# EAGLE design 24v_reg_motor (EAGLE 6.3)
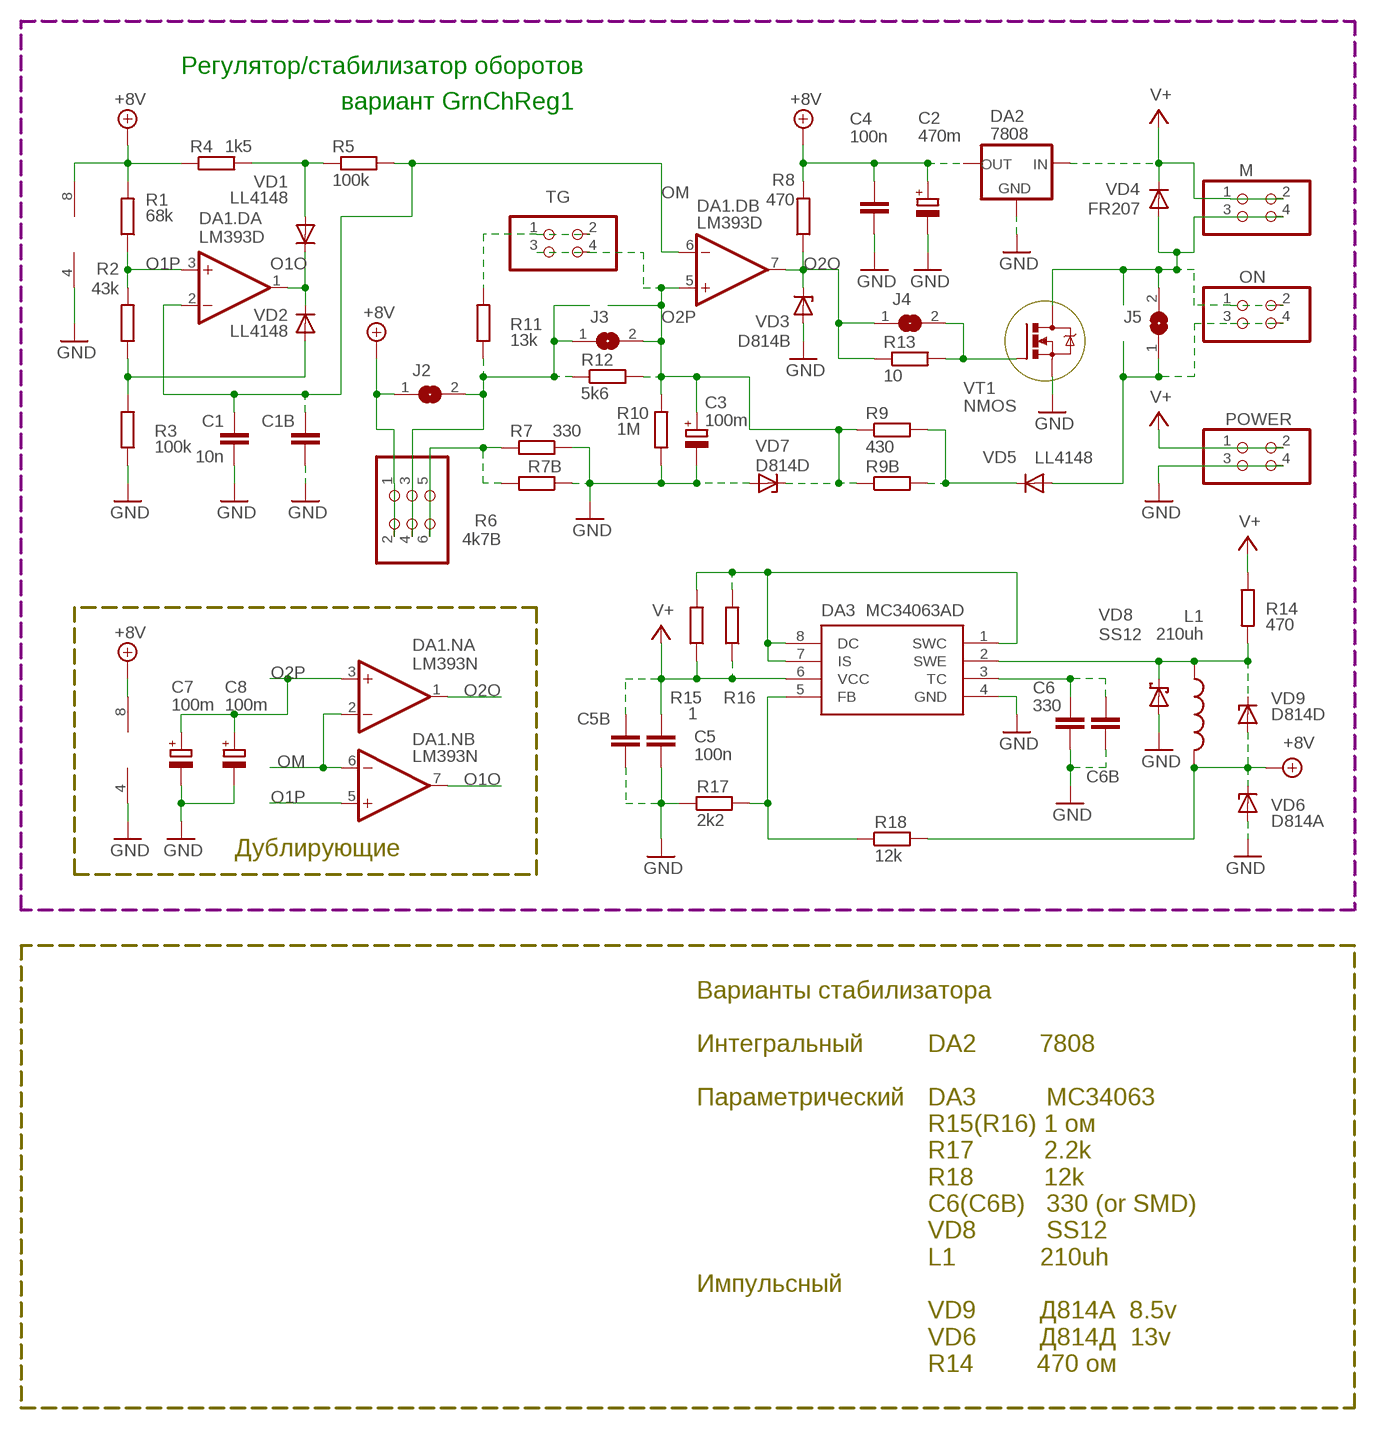
[diagram p0: schematic, sheet 1]

## Parts
C1  10n  C-EU025-025X050  [C025-025X050]
C1B  C-EUC0805  [C0805]
C2  470m  CPOL-EUE5-8.5  [E5-8,5]
C3  100m  CPOL-EUE2.5-7  [E2,5-7]
C4  100n  C-EUC1206K  [C1206K]
C5  100n  C-EU025-024X044  [C025-024X044]
C5B  C-EUC1206  [C1206]
C6  330  C-EU025-025X050  [C025-025X050]
C6B  C-EUC0805  [C0805]
C7  100m  CPOL-EUE22-6AXIAL  [E22-6]
C8  100m  CPOL-EUE22-6AXIAL  [E22-6]
DA1.D  LM393D  [SO08]
DA1.N  LM393N  [DIL08]
DA2  7808  79XXL  [79XXL]
DA3  MC34063AD  [SOIC8]
J2  SJ  [SJ]
J3  SJ  [SJ]
J4  SJ  [SJ]
J5  SJ  [SJ]
L1  210uh  L-US0207/10  [0207/10]
M  PINHD-2X2  [2X02]
ON  PINHD-2X2  [2X02]
POWER  PINHD-2X2  [2X02]
R1  68k  R-EU_0207/10  [0207/10]
R2  43k  R-EU_M0805  [M0805]
R3  100k  R-EU_M0805  [M0805]
R4  1k5  R-EU_M0805  [M0805]
R5  100k  R-EU_M0805  [M0805]
R6  4k7B  PINHD-2X3  [2X03]
R7  330  R-EU_0309/10  [0309/10]
R7B  R-EU_M0805  [M0805]
R8  470  R-EU_M0805  [M0805]
R9  430  R-EU_0207/10  [0207/10]
R9B  R-EU_R0805  [R0805]
R10  1M  R-EU_M0805  [M0805]
R11  13k  R-EU_0207/10  [0207/10]
R12  5k6  R-EU_M0805  [M0805]
R13  10  R-EU_R0805  [R0805]
R14  470  R-EU_0207/10  [0207/10]
R15  1  R-EU_M0805  [M0805]
R16  R-EU_M0805  [M0805]
R17  2k2  R-EU_M0805  [M0805]
R18  12k  R-EU_0207/10  [0207/10]
TG  PINHD-2X2  [2X02]
VD1  LL4148  DIODE-SOD80C  [SOD80C]
VD2  LL4148  DIODE-SOD80C  [SOD80C]
VD3  D814B  ZDD814  [ZDMETAL]
VD4  FR207  1N4148DO35-10  [DO35-10]
VD5  LL4148  DIODE-SOD80C  [SOD80C]
VD6  D814A  ZDD814  [ZDMETAL]
VD7  D814D  ZDD814  [ZDMETAL]
VD8  SS12  SCHOTTKY-DIODESMD  [SMB]
VD9  D814D  ZDD814  [ZDMETAL]
VT1  NMOS  NMOSD  [DPACK_1]

## Nets
34P2: DA3.2(SWE) L1.1 R14.2 VD8.C VD9.C
+8V: C2.+ C4.1 DA1.D.8(P:V+) DA1.N.8(P:V+) DA2.OUT J2.1 L1.2 R1.2 R4.1 R6.1 R6.2 R8.2 R18.2 VD6.C VD9.A
GND: C1.2 C1B.2 C2.- C3.- C4.2 C5.2 C5B.2 C6.2 C6B.2 C7.- C8.- DA1.D.4(P:V-) DA1.N.4(P:V-) DA2.GND DA3.4(GND) POWER.3 POWER.4 R3.1 R7.1 R7B.1 R10.1 R17.1 VD3.A VD6.A VD7.A VD8.A VT1.S
N$3: R2.1 R3.2 VD2.A
N$5: R4.2 R5.1 VD1.A
N$7: R6.5 R6.6 R7.2 R7B.2
N$9: DA3.1(SWC) DA3.7(IS) DA3.8(DC) R15.2 R16.2
N$11: J5.2 M.3 M.4 ON.1 ON.2 VD4.A VT1.D
N$12: J4.2 R13.2 VT1.G
N$13: R11.2 TG.1 TG.2
N$14: J5.1 ON.3 ON.4 VD5.A
N$15: R9.2 R9B.2 VD5.C
N$17: J2.2 J3.1 R6.3 R6.4 R11.1 R12.1
N$18: DA3.5(FB) R17.2 R18.1
N$20: C6.1 C6B.1 DA3.3(TC)
O1O: DA1.D.1(A:OUT) DA1.N.7(B:OUT) VD1.C VD2.C
O1P: DA1.D.3(A:+IN) DA1.N.5(B:+IN) R1.1 R2.2
O2O: DA1.D.7(B:OUT) DA1.N.1(A:OUT) J4.1 R8.1 R13.1 VD3.C
O2P: C3.+ C7.+ C8.+ DA1.D.5(B:+IN) DA1.N.3(A:+IN) J3.2 R9.1 R9B.1 R10.2 R12.2 TG.3 TG.4 VD7.C
OM: C1.1 C1B.1 DA1.D.2(A:-IN) DA1.D.6(B:-IN) DA1.N.2(A:-IN) DA1.N.6(B:-IN) R5.2
V+: C5.1 C5B.1 DA2.IN DA3.6(VCC) M.1 M.2 POWER.1 POWER.2 R14.1 R15.1 R16.1 VD4.C

## Notes on the sheet
- Регулятор/стабилизатор оборотов
- вариант GrnChReg1
- Дублирующие
- Варианты стабилизатора
- Интегральный
  
  Параметрический
  
  
  
  
  
  
  Импульсный
- DA2         7808
  
  DA3          MC34063
  R15(R16) 1 ом
  R17          2.2k
  R18          12k
  C6(C6B)   330 (or SMD)
  VD8          SS12
  L1            210uh
  
  VD9         Д814А  8.5v
  VD6         Д814Д  13v
  R14         470 ом

## Library data of the parts
C1 C1B C4 C6 C6B = rcl:C-EU: CAPACITOR, European symbol
C2 C3 C7 C8 = rcl:CPOL-EU: POLARIZED CAPACITOR, European symbol
C5 C5B = rc-elektronik:C-EU: CAPACITOR, European symbol
DA1.D DA1.N = linear:LM393: COMPARATOR
DA2 = v-reg:79XXL: VOLTAGE REGULATOR
DA3 = mc34063:MC34063
J2-J5 = jumper:SJ: SMD solder JUMPER
L1 = rcl:L-US: INDUCTOR, American symbol
M ON POWER TG = pinhead:PINHD-2X2: PIN HEADER
R1-R5 R7 R7B R8 R9 R9B R10-R18 = rcl:R-EU_: RESISTOR, European symbol
R6 = pinhead:PINHD-2X3: PIN HEADER
VD1 VD2 VD5 = diode:DIODE-: DIODE
VD3 VD6 VD7 VD9 = DSS0:ZD
VD4 = SpeccyPower5v:1N4148: DIODE high speed (Philips)
VD8 = diode:SCHOTTKY-DIODE: Schottky Diode
VT1 = DSS0:NMOS

## Board
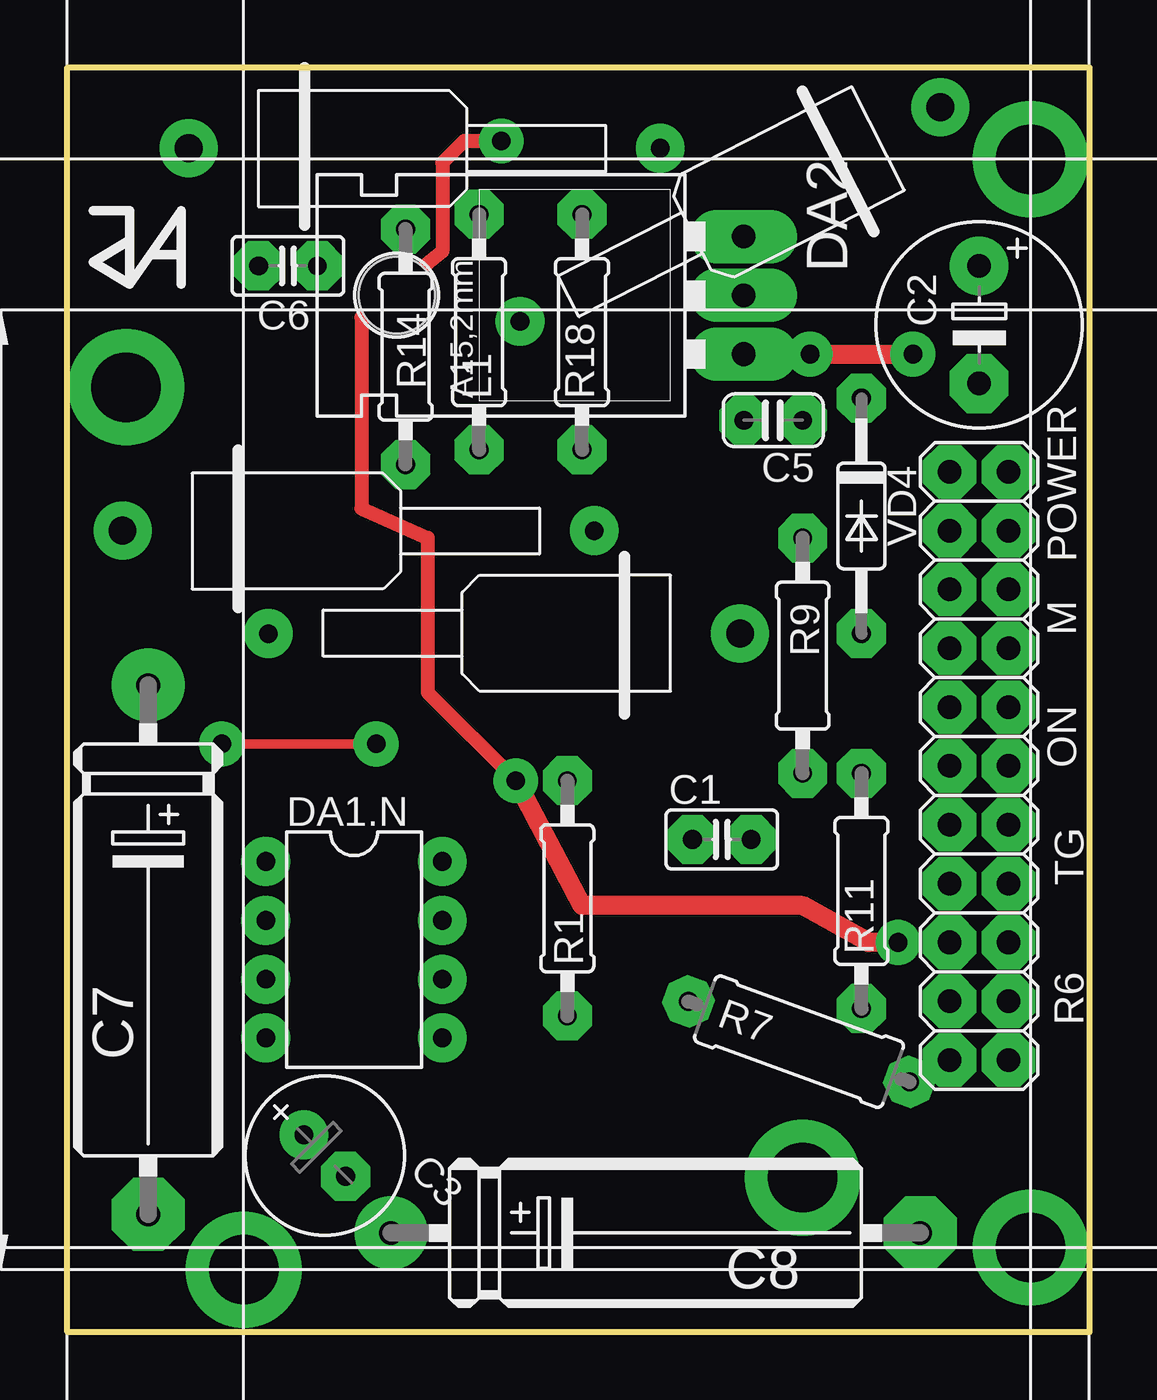
[diagram p1: board, top side]
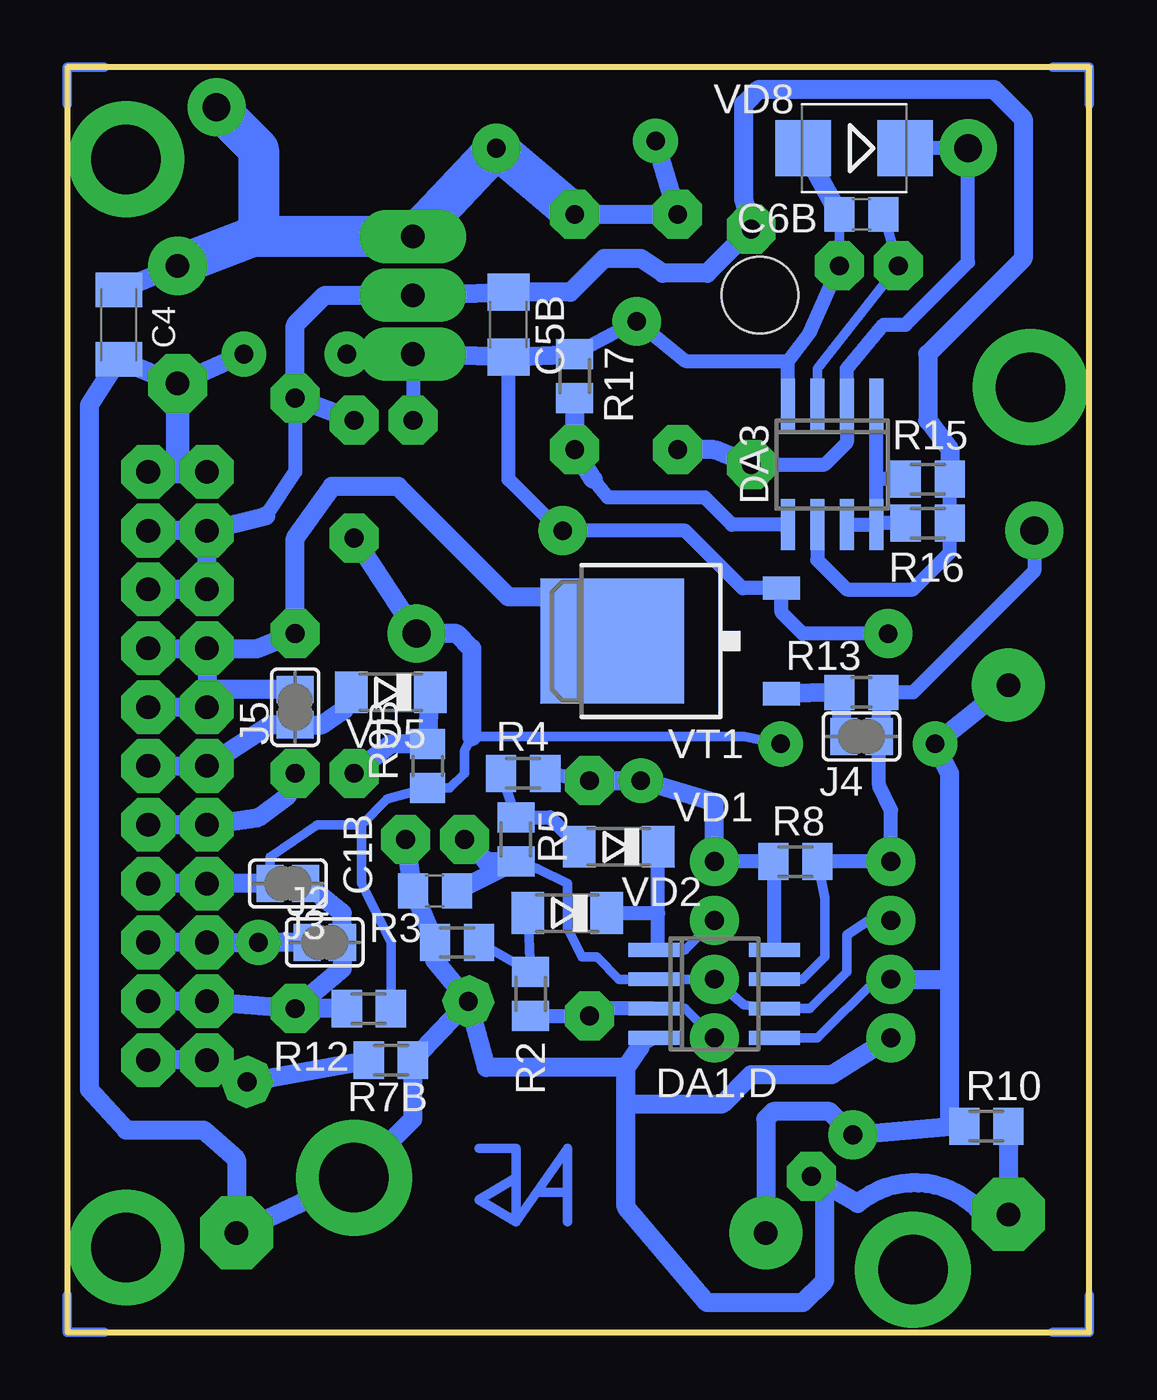
[diagram p2: board, bottom side, seen from below]

Size 44.13 x 54.61 mm. Coordinates in mm from the lower left corner, seen from the top.
Outline: 0,54.61 44.13,54.61 44.13,0 0,0 0,54.61
Copper layers (1*16): Top 0.035mm / dielectric 1.5mm / Bottom 0.035mm
Design rules "DesignRules": minimum track width 8mil, minimum drill 24mil, track to track 0.2mm, track to pad 0.2mm, pad to pad 8mil, via to via 8mil, smd to smd 8mil, copper to edge 10mil, drill to drill 8mil, minimum pad ring 0.65mm, minimum via ring 8mil, stop-mask expansion 4mil, vias tented up to drill 0mil, thermal gap 10mil

### Footprints (pad centres in the part's own frame; a part is rotated, then mirrored left to right if it is on the bottom)
C025-025X050 = drill 0.813 octagon: 1 -1.27,0; 2 1.27,0
C0805 = smd 1.3 x 1.5: 1 -0.95,0; 2 0.95,0
E5-8,5 = drill 1.016 pad 2.54: + -2.54,0 | drill 1.016 pad 2.54 octagon: - 2.54,0
E2,5-7 = drill 0.813 pad 1.6: + -1.27,0 | drill 0.813 pad 1.6 octagon: - 1.27,0
C1206K = smd 1.5 x 2: 1 -1.5,0; 2 1.5,0
C025-024X044 = drill 0.813 octagon: 1 -1.27,0; 2 1.27,0
C1206 = smd 1.6 x 1.8: 1 -1.4,0; 2 1.4,0
E22-6 = drill 1.016 pad 3.15: + -11.43,0 | drill 1.016 pad 3.15 octagon: - 11.43,0
SO08 = smd 0.6 x 2.2: 1 -1.905,-2.6; 2 -0.635,-2.6; 3 0.635,-2.6; 4 1.905,-2.6; 5 1.905,2.6; 6 0.635,2.6; 7 -0.635,2.6; 8 -1.905,2.6
DIL08 = drill 0.813 pad 1.27: 1 -3.81,-3.81; 2 -1.27,-3.81; 3 1.27,-3.81; 4 3.81,-3.81; 5 3.81,3.81; 6 1.27,3.81; 7 -1.27,3.81; 8 -3.81,3.81
79XXL = drill 1.016 long: GND -2.54,-3.81; IN 0,-3.81; OUT 2.54,-3.81 | hole 3.302: 0,11.176
SOIC8 = smd 0.6 x 2.2: 1 -1.905,-2.6; 2 -0.635,-2.6; 3 0.635,-2.6; 4 1.905,-2.6; 5 1.905,2.6; 6 0.635,2.6; 7 -0.635,2.6; 8 -1.905,2.6
SJ = smd 1.168 x 1.6: 1 -0.762,0; 2 0.762,0
0207/10 = drill 0.813 octagon: 1 -5.08,0; 2 5.08,0
2X02 = drill 1.016 octagon: 1 -1.27,-1.27; 2 -1.27,1.27; 3 1.27,-1.27; 4 1.27,1.27
M0805 = smd 1.3 x 1.6: 1 -0.95,0; 2 0.95,0
2X03 = drill 1.016 octagon: 1 -2.54,-1.27; 2 -2.54,1.27; 3 0,-1.27; 4 0,1.27; 5 2.54,-1.27; 6 2.54,1.27
0309/10 = drill 0.813 octagon: 1 -5.08,0; 2 5.08,0
R0805 = smd 1.3 x 1.5: 1 -0.95,0; 2 0.95,0
SOD80C = smd 1.4 x 1.8: A 1.7,0; C -1.7,0
ZDMETAL = drill 0.8 pad 2: A 12.27,0 | drill 1.2 pad 2.5: C -8.095,0
DO35-10 = drill 0.813 octagon: A 5.08,0; C -5.08,0
SMB = smd 2.4 x 2.4: A 2.2,0; C -2.2,0
DPACK_1 = smd 5.4 x 6.2: D 0,2.5 | smd 1 x 1.6: G -2.28,-4.8; S 2.28,-4.8

### Placement (x,y rotation side)
C1  28.26,21.27 0 top
C1B  28.26,19.05 180 bottom
C2  39.37,43.5 270 top
C3  11.11,7.62 315 top
C4  41.91,43.5 270 bottom
C5  30.48,39.37 180 top
C5B  25.08,43.5 270 bottom
C6  9.53,46.04 0 top
C6B  9.84,48.26 180 bottom
C7  3.49,16.51 270 top
C8  25.4,4.29 0 top
DA1.D  16.19,14.61 270 bottom
DA1.N  12.38,16.51 270 top
DA2  25.4,44.77 90 top
DA3  11.11,37.47 180 bottom
J2  33.02,16.83 0 bottom
J3  34.61,19.37 180 bottom
J4  9.84,25.72 180 bottom
J5  34.29,26.99 90 bottom
L1  17.78,43.18 90 top
M  39.37,30.8 270 top
ON  39.37,25.72 270 top
POWER  39.37,35.88 90 top
R1  21.59,18.73 90 top
R2  24.13,14.61 270 bottom
R3  27.3,16.83 0 bottom
R4  24.45,24.13 180 bottom
R5  24.77,21.27 270 bottom
R6  39.37,14.29 270 top
R7  31.59,12.54 340 top
R7B  30.16,11.75 180 bottom
R8  12.7,20.32 180 bottom
R9  31.75,29.21 270 top
R9B  28.57,24.45 90 bottom
R10  4.45,8.89 180 bottom
R11  34.29,19.05 90 top
R12  31.11,13.97 0 bottom
R13  9.84,27.62 180 bottom
R14  14.61,42.55 270 top
R15  6.99,36.83 180 bottom
R16  6.99,34.92 180 bottom
R17  22.23,41.27 270 bottom
R18  22.23,43.18 90 top
TG  39.37,20.64 270 top
VD1  20.32,20.95 180 bottom
VD2  22.54,18.1 180 bottom
VD3  10.48,34.61 0 top
VD4  34.29,35.24 270 top
VD5  30.16,27.62 180 bottom
VD6  30.48,49.21 207 top
VD7  20.95,30.16 180 top
VD8  10.16,51.12 180 bottom
VD9  13.34,51.12 0 top
VT1  18.1,29.84 90 bottom

### Tracks (layer width: path | path; a pad name or v marks a point on that pad's centre or on a via)
34P2
  Bottom 0.61: VD8.C VD9.C 5.24,46.2 7.94,43.5 8.89,43.5 10.48,41.59 DA3.2 10.48,38.42 11.43,37.47 R14.2
  Bottom 0.813: R14.2 16.19,38.1 L1.1
+8V  (via drill 0.8 pad 1.93)
  Top 0.61: v18.73,51.44 17.14,51.44 16.19,50.48 16.19,46.67 12.7,43.81 12.7,35.56 15.56,34.29 15.56,27.62 v19.37,23.81
  Top 0.813: v35.88,16.83 34.61,16.83 31.75,18.41 22.23,18.41 v19.37,23.81
  Bottom 0.61: R1.2 R4.1 | DA1.N.8 R8.2 13.59,20.26 DA1.D.8
  Bottom 0.813: C4.1 C2.+ | R18.2 L1.2 v18.73,51.44 | J2.1 v35.88,16.83 R6.1 R6.2 | DA1.N.8 16.19,22.86 v19.37,23.81 R1.2
  Bottom 1.778: R18.2 VD9.A DA2.OUT 35.88,47.31 | 35.88,47.31 36.1,47.31 C2.+ | VD6.C 35.88,51.07 35.88,47.31
GND  (via drill 0.8 pad 1.93, 3 pad 5)
  Top 0.813: v32.07,42.23 v36.51,42.23
  Bottom 0.406: C6.2 C6B.2
  Bottom 0.61: C5B.2 25.08,36.83 22.86,34.61 VD3.A 17.46,34.61 14.98,32.12 VT1.S 13.3,31.08 12.38,30.16 VD7.A | DA2.GND C5.2 | C6.2 12.06,43.18 13.02,41.94 | 13.02,41.94 17.44,41.94 VD6.A R17.1 | DA1.D.4 19.37,12.38 | DA3.4 13.02,41.94
  Bottom 0.813: 20,9.84 20,5.4 16.51,1.27 12.38,1.27 11.43,2.22 11.43,5.08 11.41,6.38 | 20,9.84 20,11.43 | 20,11.43 26.04,11.43 R7.1 | R17.1 C5B.2 DA2.GND v32.07,42.23 | R7.1 R7B.1 29.21,9.21 v31.75,6.67 C8.- 36.83,7.46 38.26,8.73 41.59,8.73 43.18,10.48 43.18,40.01 C4.2 C2.- v36.51,42.23 | R7.1 28.25,16.03 R3.1 C1B.2 C1.2 | C6B.2 VD8.A | 19.37,12.38 20,11.43 | POWER.4 39.37,37.15 POWER.3 | R10.1 3.49,9.21 C7.- 4.6,5.08 arc-90 10,5.56 11.41,6.38 | DA1.N.4 11.11,11.11 14.61,11.11 15.88,9.84 20,9.84 | 11.41,6.38 C3.-
  Bottom 1.016: C2.- 39.37,37.15
N$1
  Bottom 0.406: 22.54,4.76 22.54,6.03 | 22.54,6.03 22.54,7.94 24.77,4.76 | 24.77,4.76 26.35,5.71 24.77,6.67 | 24.77,6.67 24.77,7.94 26.35,7.94 | 24.77,4.76 24.77,6.67 | 22.54,6.03 23.81,6.03
N$2
  Bottom 0.406: 42.55,54.61 44.13,54.61 44.13,53.02
N$3
  Bottom 0.406: R3.2 R2.1 VD2.A
N$4
  Bottom 0.406: 1.59,54.61 0,54.61 0,53.02
N$5
  Bottom 0.406: R4.2 R5.1
  Bottom 0.61: R5.1 23.29,22.23 VD1.A
N$7
  Bottom 0.813: R7B.2 R7.2 R6.5 R6.6
N$9
  Bottom 0.61: DA3.7 DA3.8 9.21,34.92 | 9.21,34.92 9.21,36.83 | 9.21,36.83 DA3.1 | R15.2 9.21,36.83 | R16.2 9.21,34.92
N$10  (via drill 3 pad 5)
  other vias: 41.59,3.65
N$11
  Bottom 0.813: VT1.D 22.5,31.75 25.08,31.75 29.84,36.51 32.7,36.51 34.29,34.29 VD4.A 35.88,29.53 M.3 | M.4 M.3 | M.3 ON.1 | ON.2 ON.1 | J5.2 38.1,27.75 ON.1
N$12
  Bottom 0.813: VT1.G R13.2 J4.2
N$13
  Bottom 0.813: R11.2 34.61,23.18 35.88,22.23 TG.1 TG.2
N$14
  Bottom 0.406: 34.48,26.04 J5.1
  Bottom 0.813: VD5.A 32.18,26.88 33.15,26.23 J5.1 35.37,26.23 ON.3 ON.4
N$15
  Bottom 0.813: R9.2 30.16,25.4 R9B.2 VD5.C
N$16  (via drill 3 pad 5)
  other vias: 41.59,50.64
N$17
  Bottom 0.813: R11.1 32.26,15.68 J2.2 32.26,18.1 J3.1 | R12.1 33.34,13.97 R11.1 | R11.1 R6.3 R6.4
N$18
  Bottom 0.61: 21.43,36.83 20.8,36.04 16.61,36.04 15.44,34.87 DA3.5
  Bottom 0.813: R17.2 R18.1 21.43,36.83
N$19  (via drill 3 pad 5)
  other vias: 2.54,40.8
N$20
  Bottom 0.406: DA3.3 11.75,41.59 C6.1 C6B.1
N$21  (via drill 3 pad 5)
  other vias: 7.62,2.7
N$22
  Bottom 0.406: 0,1.59 0,0 1.59,0
N$23
  Bottom 0.406: 44.13,1.59 44.13,0 42.55,0
O1O
  Bottom 0.406: DA1.D.1 17.46,16.51 DA1.N.7
  Bottom 0.61: DA1.D.1 18.62,16.51 18.62,18.1 | 18.62,18.1 VD1.C | VD2.C 18.62,18.1
O1P
  Bottom 0.406: DA1.D.3 17.46,13.97 DA1.N.5
  Bottom 0.61: DA1.D.3 21.27,13.97 R1.1 22.55,13.65 R2.2
O2O
  Bottom 0.406: DA1.D.7 12.38,15.24 11.43,16.19 11.43,18.73 R8.1
  Bottom 0.61: R8.1 DA1.N.1 8.57,22.54 9.08,23.62 J4.1 | R13.1 7.62,27.62 2.38,32.86 VD3.C
  Bottom 0.813: R13.1 J4.1
O2P  (via drill 0.8 pad 1.93)
  Top 0.406: v13.34,25.4 v6.67,25.4
  Bottom 0.406: DA1.D.5 11.75,12.7 9.21,15.24 DA1.N.3 | J3.2 35.37,20.51 33.34,21.91 31.43,21.91 | v13.34,25.4 14.92,25.72 26.67,25.72 26.99,25.08 26.99,24.13 27.62,23.5 R9B.1 30.32,23.02 31.43,21.91 | 31.43,21.91 31.43,19.37 30.16,16.83 R12.2
  Bottom 0.813: R9.1 VD7.C 27.3,30.16 26.67,29.53 26.67,25.72 | 6.03,8.89 6.03,15.24 | DA1.N.3 6.03,15.24 | 6.03,15.24 6.03,24.13 v6.67,25.4 C7.+ | 6.03,8.89 R10.2 | J3.2 TG.3 TG.4 | 6.03,8.89 C3.+ 11.22,9.53 13.65,9.53 13.97,9.21 C8.+
OM
  Bottom 0.406: DA1.N.2 9.53,17.78 10.48,17.14 10.48,15.56 12.06,13.97 DA1.D.6 14.92,14.13 DA1.N.6 DA1.D.2 20.32,15.24 21.27,16.19 21.91,16.19 22.54,17.46 22.54,19.37 23.81,20 R5.2
  Bottom 0.813: C1B.1 R5.2 26.04,20.32 C1.1
V+
  Bottom 0.61: DA3.6 11.75,33.34 10.48,32.07 7.62,32.07 6.03,33.66 6.03,33.65 R16.1 R15.1 6.03,38.1 | VD4.C 34.29,37.15 35.56,35.24
  Bottom 0.813: C5.1 VD4.C 34.29,43.5 33.02,44.77 DA2.IN C5B.1 22.41,44.9 20.95,46.35 19.37,46.35 18.41,45.72 16.51,45.72 R14.1 14.92,48.9 14.92,53.02 14.29,53.66 4.13,53.66 2.86,52.39 2.86,46.35 6.99,42.23 6.99,39.37 6.04,38.1 R15.1 | POWER.2 POWER.1 | POWER.2 M.1 M.2 | POWER.2 35.56,35.24